# EAGLE design Modu_control_revD (EAGLE 7.4.0)
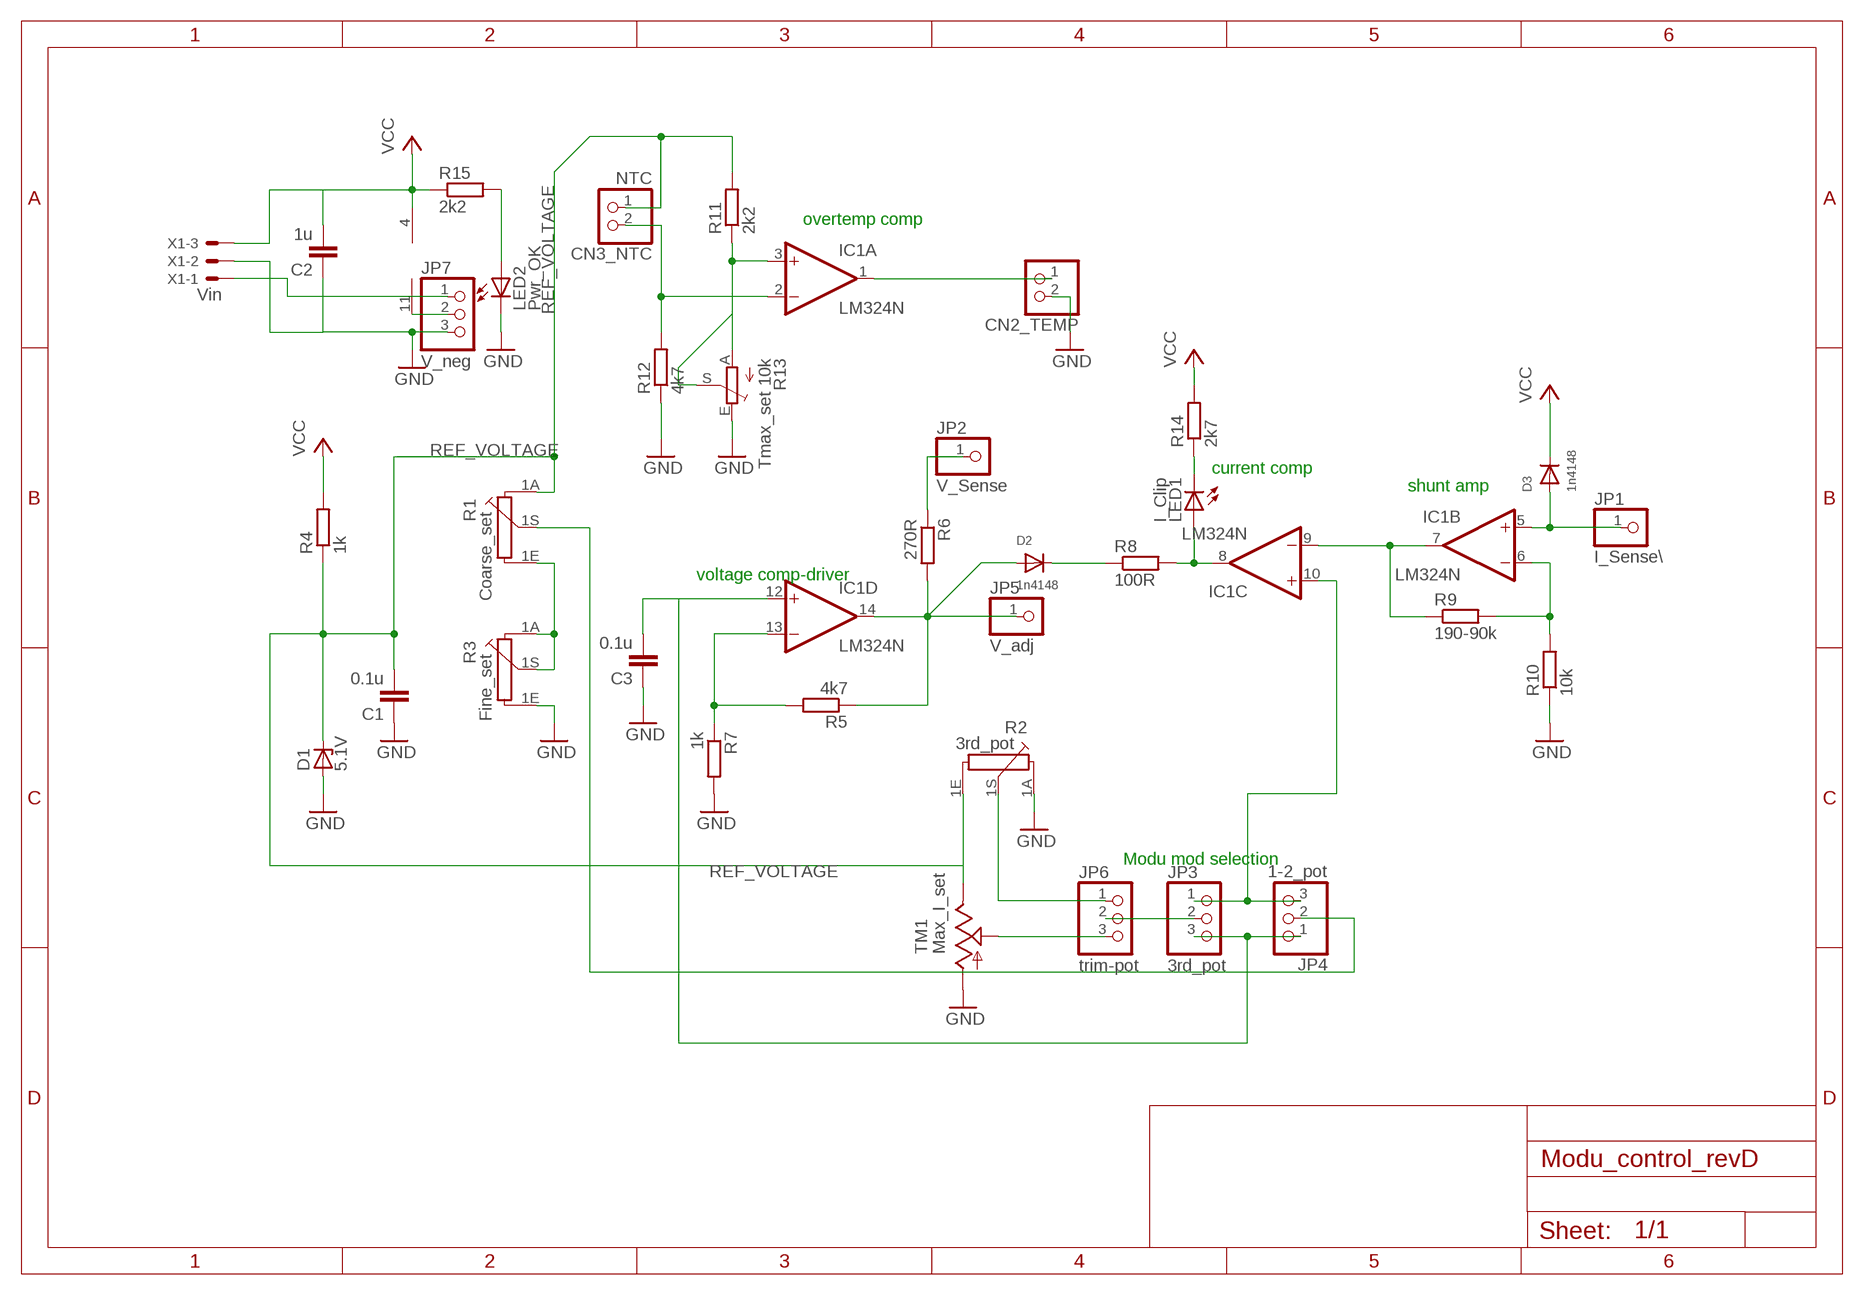
[diagram p0: schematic, sheet 1]

## Parts
C1  0.1u  C-EU050-025X075  [C050-025X075]
C2  1u  C-EU050-025X075  [C050-025X075]
C3  0.1u  C-EU050-025X075  [C050-025X075]
CN2_TEMP  JST_2PIN-THM  [JST-PH-2-THM]
CN3_NTC  NTC  JST_2PIN-THM  [JST-PH-2-THM]
D1  5.1V  ZENER-DIODEDO35Z10  [DO35Z10]
D2  1n4148  DIODEDO-1N4148  [DO-1N4148]
D3  1n4148  DIODEDO-1N4148  [DO-1N4148]
IC1  LM324N  [DIL14]
JP1  I_Sense\  PINHD-1X1  [1X01]
JP2  V_Sense  PINHD-1X1  [1X01]
JP3  3rd_pot  PINHD-1X3  [1X03]
JP4  1-2_pot  PINHD-1X3  [1X03]
JP5  V_adj  PINHD-1X1  [1X01]
JP6  trim-pot  PINHD-1X3  [1X03]
JP7  V_neg  PINHD-1X3  [1X03]
LED1  I_Clip  LED3MM  [LED3MM]
LED2  Pwr_OK  LED3MM  [LED3MM]
R1  Coarse_set  PC16S  [PC16S]
R2  3rd_pot  PC16S  [PC16S]
R3  Fine_set  PC16S  [PC16S]
R4  1k  R-EU_0207/10  [0207/10]
R5  4k7  R-EU_0204/2V  [0204V]
R6  270R  R-EU_0204/2V  [0204V]
R7  1k  R-EU_0204/7  [0204/7]
R8  100R  R-EU_0204/2V  [0204V]
R9  190-90k  R-EU_0204/2V  [0204V]
R10  10k  R-EU_0204/7  [0204/7]
R11  2k2  R-EU_0204/7  [0204/7]
R12  4k7  R-EU_0204/2V  [0204V]
R13  Tmax_set 10k  TRIM_EU-B25P  [B25P]
R14  2k7  R-EU_0204/2V  [0204V]
R15  2k2  R-EU_0204/2V  [0204V]
TM1  Max_I_set  TRIM  [6MM]
X1  Vin  JST-XH-03-PIN-LONG-PAD  [JST-XH-03-PACKAGE-LONG-PAD]

## Nets
GND: C1.1 C2.1 C3.1 CN2_TEMP.2 D1.A JP7.3 LED2.K(C) R2.1A R3.1E R7.2 R10.1 R12.1 R13.E TM1.A X1.2
N$1: CN2_TEMP.1 IC1.1(A:OUT)
N$2: CN3_NTC.2 IC1.2(A:-IN) R12.2
N$3: IC1.13(D:-IN) R5.2 R7.1
N$4: D2.A IC1.14(D:OUT) JP5.1 R5.1 R6.2
N$5: JP2.1 R6.1
N$6: R1.1E R3.1A R3.1S
N$7: C3.2 IC1.12(D:+IN) JP3.3 JP4.1
N$10: D2.C R8.1
N$11: IC1.8(C:OUT) LED1.A R8.2
N$12: D3.A IC1.5(B:+IN) JP1.1
N$13: IC1.6(B:-IN) R9.2 R10.2
N$14: IC1.7(B:OUT) IC1.9(C:-IN) R9.1
N$15: IC1.10(C:+IN) JP3.1 JP4.3
N$16: LED1.K(C) R14.1
N$17: JP6.3 TM1.S
N$18: IC1.3(A:+IN) R11.1 R13.A R13.S
N$21: JP3.2 JP6.2
N$22: JP6.1 R2.1S
N$24: IC1.11(P:V-) JP7.2
N$25: JP4.2 R1.1S
N$26: JP7.1 X1.1
N$29: LED2.A R15.2
REF_VOLTAGE: C1.2 CN3_NTC.1 D1.C R1.1A R2.1E R4.1 R11.2 TM1.E
VCC: C2.2 D3.C IC1.4(P:V+) R4.2 R14.2 R15.1 X1.3

## Notes on the sheet
- overtemp comp
- current comp
- shunt amp
- voltage comp-driver
- Modu mod selection

## Library data of the parts
C1-C3 = rcl:C-EU: CAPACITOR, European symbol
CN2_TEMP CN3_NTC = adafruit:JST_2PIN: JST 2-Pin Connectors of various flavors SMT-RA (S2B-PH-SM4) 4UConnector #17311 SMT (B2B-PH-SM4) THM-RA (S2B-PH) THM (B2B-PH)
D1 = diode:ZENER-DIODE: Z-Diode
D2 D3 = adafruit:DIODE: Diode SMADIODE - SMA Surface Mount Package 20V 1A Schottky Diode Digikey: 641-1014-6-ND DO-1N4148 - Through Hole Small Current Diode SOD-123 20V 1 A (.5mV Vf) Schottky Diode - Digikey: MBRX120TPMSCT-ND SOD-323 10V 570mA (.38mV Vf, 3ns) Schottky Diode - Digikey: ZLLS410CT-ND SOD-523 30V 30mA Schottky Diode (RB751S-40TE61) - Digikey: RB751S-40TE61CT-ND SOT23-R/W - SOT23 Package (R = Solder Paste/Reflow Ovens, W = Hand-Soldering) BAT54Film 40V 300mA - Digikey: 497-7162-1-ND
IC1 = linear:LM324: OP AMP
JP1 JP2 JP5 = adafruit:PINHD-1X1: Pin header 1x1 for 0.1" spacing With round pins
JP3 JP4 JP6 JP7 = adafruit:PINHD-1X3: PIN HEADER
LED1 LED2 = adafruit:LED: LED OSRAM: - CHIPLED LG R971, LG N971, LY N971, LG Q971, LY Q971, LO R971, LY R971 LH N974, LH R974 LS Q976, LO Q976, LY Q976 LO Q996 - Hyper CHIPLED LW Q18S LB Q993, LB Q99A, LB R99A - SideLED LS A670, LO A670, LY A670, LG A670, LP A670 LB A673, LV A673, LT A673, LW A673 LH A674 LY A675 LS A676, LA A676, LO A676, LY A676, LW A676 LS A679, LY A679, LG A679 - Hyper Micro SIDELED® LS Y876, LA Y876, LO Y876, LY Y876 LT Y87S - SmartLED LW L88C, LW L88S LB L89C, LB L89S, LG L890 LS L89K, LO L89K, LY L89K LS L896, LA L896, LO L896, LY L896 - TOPLED LS T670, LO T670, LY T670, LG T670, LP T670 LSG T670, LSP T670, LSY T670, LOP T670, LYG T670 LG T671, LOG T671, LSG T671 LB T673, LV T673, LT T673, LW T673 LH T674 LS T676, LA T676, LO T676, LY T676, LB T676, LH T676, LSB T676, LW T676 LB T67C, LV T67C, LT T67C, LS T67K, LO T67K, LY T67K, LW E67C LS E67B, LA E67B, LO E67B, LY E67B, LB E67C, LV E67C, LT E67C LW T67C LS T679, LY T679, LG T679 LS T770, LO T770, LY T770, LG T770, LP T770 LB T773, LV T773, LT T773, LW T773 LH T774 LS E675, LA E675, LY E675, LS T675 LS T776, LA T776, LO T776, LY T776, LB T776 LHGB T686 LT T68C, LB T68C - Hyper Mini TOPLED® LB M676 - Mini TOPLED Santana® LG M470 LS M47K, LO M47K, LY M47K Source: http://www.osram.convergy.de/
R1-R3 = piher:PC16S: POTENTIOMETER single carbon potentiometer, 16 mm, S3ROH; OC_FARNELL: 4452940; OC_NEWARK: unknown
R4-R12 R14 R15 = rcl:R-EU_: RESISTOR, European symbol
R13 = pot:TRIM_EU-: POTENTIOMETER
TM1 = adafruit:TRIM
X1 = Rembrandt Electronics - JST XH Connectors v1-0:JST-XH-03-PIN: JST XH Connector 2 Pin Wire to board connector. Pitch: 2,54 mm, (0.100") Number of pins: 3 Created by Rembrandt Electronics www.rembrandtelectronics.com

## Board
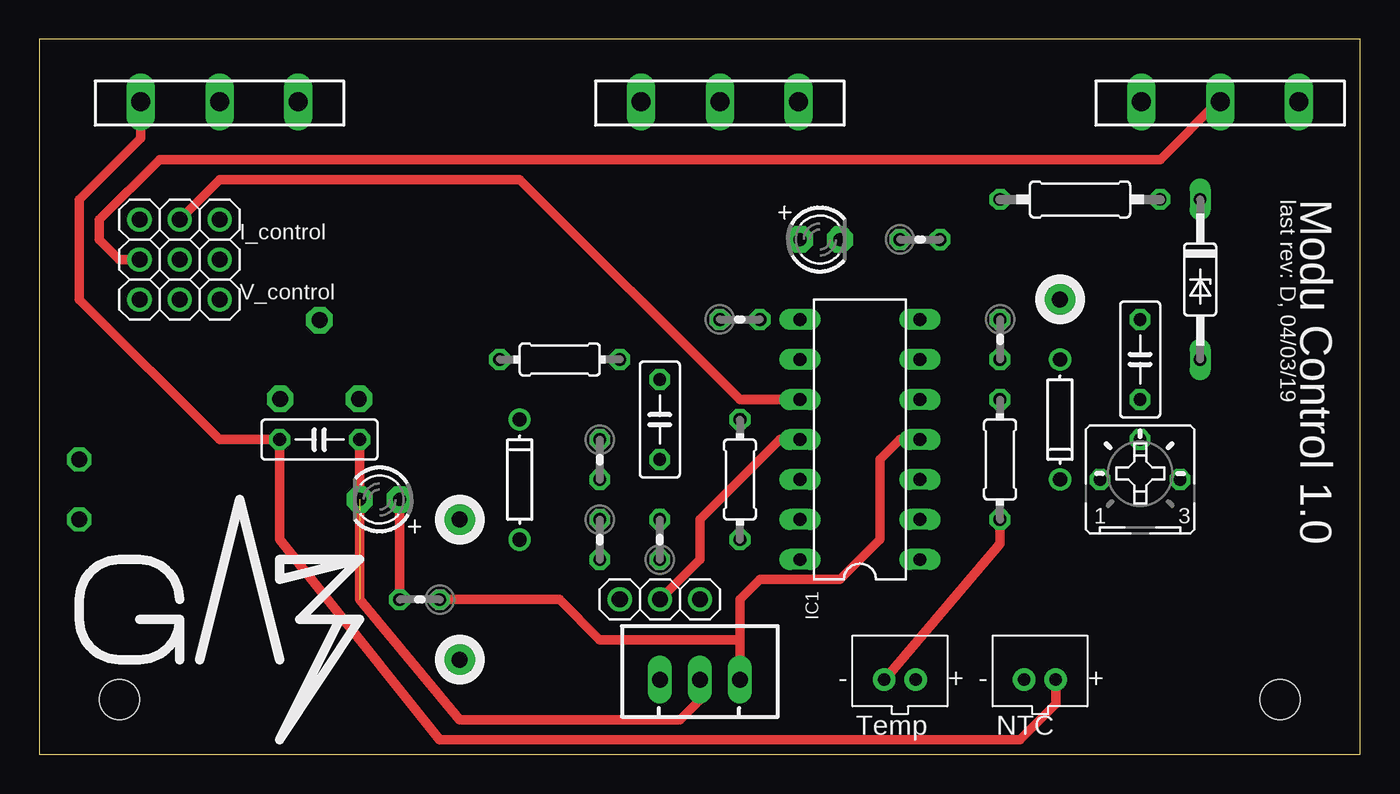
[diagram p1: board, top side]
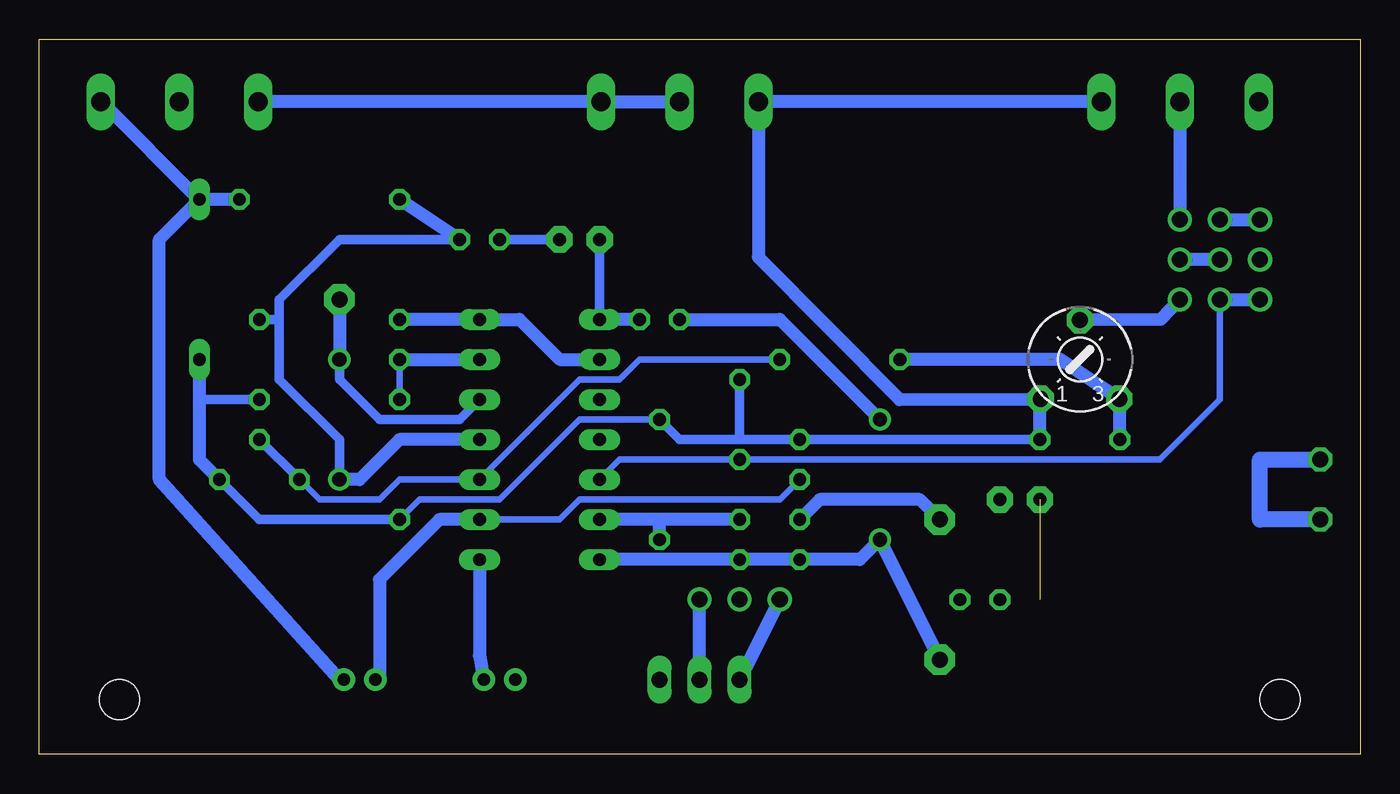
[diagram p2: board, bottom side, seen from below]

Size 83.81 x 45.39 mm. Coordinates in mm from the lower left corner, seen from the top.
Outline: 0,45.39 0,0 83.81,0 83.81,45.39 0,45.39
Copper layers (1*16): Top 0.035mm / dielectric 1.5mm / Bottom 0.035mm
Design rules "default": minimum track width 10mil, minimum drill 24mil, track to track 8mil, track to pad 8mil, pad to pad 8mil, via to via 8mil, smd to smd 8mil, copper to edge 40mil, drill to drill 8mil, minimum pad ring 10mil, minimum via ring 8mil, stop-mask expansion 4mil, vias tented up to drill 0mil, thermal gap 10mil
Holes 2.54 mm at 5.08,3.48 78.74,3.48

### Footprints (pad centres in the part's own frame; a part is rotated, then mirrored left to right if it is on the bottom)
C050-025X075 = drill 0.813 octagon: 1 -2.54,0; 2 2.54,0
JST-PH-2-THM = drill 0.8 pad 1.422: 1 1,0; 2 -1,0
DO35Z10 = drill 0.813 long: A 5.08,0; C -5.08,0
DO-1N4148 = drill 0.9: A -3.81,0; C 3.81,0
DIL14 = drill 0.813 long: 1 -7.62,-3.81; 2 -5.08,-3.81; 3 -2.54,-3.81; 4 0,-3.81; 5 2.54,-3.81; 6 5.08,-3.81; 7 7.62,-3.81; 8 7.62,3.81; 9 5.08,3.81; 10 2.54,3.81; 11 0,3.81; 12 -2.54,3.81; 13 -5.08,3.81; 14 -7.62,3.81
1X01 = drill 1.016 pad 1.93 octagon: 1 0,0
1X03 = drill 1.016: 1 -2.54,0; 2 0,0; 3 2.54,0
LED3MM = drill 0.813 pad 1.676 octagon: A -1.27,0; K 1.27,0
PC16S = drill 1.2 long: 1A -5,6.5; 1E 5,6.5; 1S 0,6.5
0207/10 = drill 0.813 octagon: 1 -5.08,0; 2 5.08,0
0204V = drill 0.813 octagon: 1 -1.27,0; 2 1.27,0
0204/7 = drill 0.813 octagon: 1 -3.81,0; 2 3.81,0
B25P = drill 0.813 octagon: A -2.54,0; E 2.54,0; S 0,2.54
6MM = drill 1 pad 1.676 octagon: A -2.5,-2.5; E 2.5,-2.5; S 0,2.5
JST-XH-03-PACKAGE-LONG-PAD = drill 1.016 long: 1 -2.54,0; 2 0,0; 3 2.54,0

### Placement (x,y rotation side)
C1  17.78,19.99 180 top
C2  69.85,25.07 90 top
C3  39.37,21.26 270 top
CN2_TEMP  Temp  [JST-PH-2-THM]  54.61,4.75 0 top
CN3_NTC  63.5,4.75 0 top
D1  73.66,30.15 270 top
D2  30.48,17.45 90 top
D3  64.77,21.26 270 top
IC1  52.07,19.99 90 top
JP1  64.77,28.88 270 top
JP2  26.67,14.91 270 top
JP3  8.89,31.42 270 top
JP4  6.35,31.42 90 top
JP5  26.67,6.02 270 top
JP6  11.43,31.42 270 top
JP7  39.37,9.83 0 top
LED1  49.53,32.69 0 top
LED2  21.59,16.18 180 top
R1  74.93,47.93 180 top
R2  11.43,47.93 180 top
R3  43.18,47.93 180 top
R4  66.04,35.23 180 top
R5  39.37,13.64 90 top
R6  35.56,13.64 270 top
R7  44.45,17.45 90 top
R8  44.45,27.61 0 top
R9  60.96,26.34 270 top
R10  60.96,18.72 90 top
R11  33.02,25.07 180 top
R12  35.56,18.72 270 top
R13  69.85,17.45 0 top
R14  55.88,32.69 0 top
R15  24.13,9.83 180 top
TM1  17.78,25.07 0 bottom
X1  41.91,4.75 0 top

### Tracks (layer width: path | path; a pad name or v marks a point on that pad's centre or on a via)
GND  (1 unrouted)
  Top 0.61: C1.1 20.32,9.83 26.67,2.21 40.64,2.21 41.91,3.48 X1.2 | R10.1 60.96,13.37 CN2_TEMP.2
  Bottom 0.406: R7.2 49.53,21.26 54.61,16.18 59.69,16.18 R10.1
  Bottom 0.61: 39.37,19.99 43.18,19.99 R7.2 | 39.37,19.99 R12.1 C1.1 | C3.1 39.37,19.99 | R13.E 69.85,14.91 R10.1 | C2.1 73.66,22.53
  Bottom 0.813: R2.1A R3.1E 38.18,31.58 29.21,22.53 TM1.A 20.32,22.53 C1.1 | D1.A 73.66,22.53 73.66,18.72 R13.E | X1.2 JP7.3
N$1
  Bottom 0.813: IC1.1 55.88,6.29 CN2_TEMP.1
N$2
  Bottom 0.406: R12.2 36.83,16.18 49.53,16.18 50.8,14.91 IC1.2
  Bottom 0.813: IC1.2 58.42,14.91 62.23,11.1 62.23,5.02 CN3_NTC.2
N$3
  Bottom 0.813: R5.2 44.45,14.91 | 44.45,14.91 IC1.13 | R7.1 44.45,14.91
N$4
  Bottom 0.813: IC1.14 R5.1 R6.2 31.75,12.37 D2.A JP5.1
N$5
  Bottom 0.813: JP2.1 27.94,16.18 34.29,16.18 R6.1
N$6
  Bottom 0.813: R3.1S R3.1A 69.7,41.43 69.85,41.58 69.85,41.51 R1.1E
N$7
  Bottom 0.406: JP3.3 8.89,22.53 12.7,18.72 C3.2 46.99,18.72 IC1.12
  Bottom 0.813: JP3.3 JP4.1
N$10
  Bottom 0.813: R8.1 36.83,27.61 D2.C
N$11
  Bottom 0.61: LED1.A IC1.8
  Bottom 0.813: R8.2 IC1.8
N$12
  Bottom 0.61: D3.A 64.77,23.8 62.23,21.26 57.15,21.26 IC1.5
  Bottom 0.813: JP1.1 D3.A
N$13
  Bottom 0.406: R10.2 R9.2
  Bottom 0.813: R9.2 IC1.6
N$14
  Bottom 0.813: IC1.9 50.8,25.07 53.34,27.61 IC1.7 R9.1
N$15
  Top 0.61: JP3.1 11.43,36.5 30.48,36.5 44.45,22.53 IC1.10
  Bottom 0.813: JP3.1 JP4.3
N$16
  Bottom 0.61: LED1.K R14.1
N$17
  Bottom 0.813: JP6.3 12.66,27.61 TM1.S
N$18
  Bottom 0.406: R13.A 66.04,16.18 62.23,16.18 60.96,17.45 IC1.3 49.53,23.8 46.99,23.8 45.72,25.07 R11.1
  Bottom 0.61: R13.S R13.A
N$21
  Bottom 0.813: JP3.2 JP6.2
N$22
  Bottom 0.813: R2.1S JP6.1
N$24
  Top 0.61: JP7.2 41.91,12.37 41.91,14.91 46.99,19.99 IC1.11
N$25
  Top 0.61: JP4.2 5.08,31.42 3.81,32.69 3.81,33.96 7.62,37.77 71.12,37.77 74.93,41.58 R1.1S
N$26
  Bottom 0.813: JP7.1 X1.1
N$27  (via drill 1.02 pad 0.25)
  Bottom 1.016: v2.54,14.91 6.35,14.91 6.35,18.72 v2.54,18.72
N$29
  Top 0.61: R15.2 LED2.A
REF_VOLTAGE
  Top 0.61: R2.1E 6.43,39.12 2.54,35.23 2.54,28.88 11.43,19.99 C1.2 15.24,13.64 25.4,0.94 62.23,0.94 64.5,3.21 CN3_NTC.1
  Bottom 0.813: C1.2 15.28,20.03 TM1.E 19.05,25.07 R11.2 | R4.1 D1.C | R1.1A 79.86,41.43 D1.C | CN3_NTC.1 64.5,5.02 64.77,4.75 76.2,17.45 76.2,32.69 D1.C
VCC
  Top 0.61: X1.3 44.45,7.29 | 44.45,7.29 44.45,9.83 45.72,11.1 50.8,11.1 53.34,13.64 53.34,18.72 54.61,19.99 IC1.4 | R15.1 33.02,9.83 35.56,7.29 44.45,7.29
  Bottom 0.61: R14.2 64.77,32.69 68.58,28.88 68.58,27.61 | 68.58,27.61 68.58,23.8 64.77,19.99 D3.C | C2.2 68.58,27.61
  Bottom 0.813: R14.2 R4.2 | IC1.4 60.96,19.99 63.5,17.45 D3.C

### Text on the board
tPlace: last rev: D, 04/03/19 | Modu Control 1.0 | I_control | V_control
tValues: tag